# EAGLE design SunriseClockMainv3 (EAGLE 7.6.0)
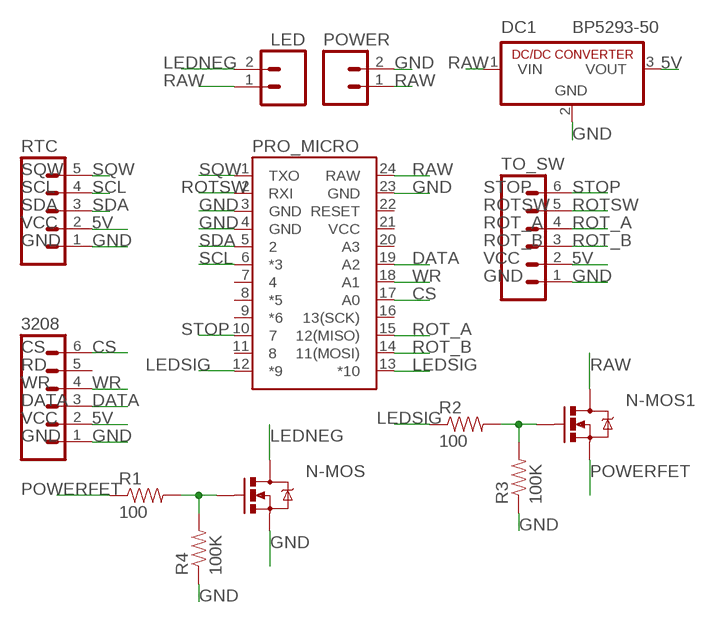
[diagram p0: schematic, sheet 1]

## Parts
3208  M06LOCK  [1X06_LOCK]
DC1  BP5293-50  R-78C5.0-1.0  [SIP3]
LED  M02LOCK  [1X02_LOCK]
N-MOS  MOSFET-NCHANNELFQP30N06L  [TO220V]
N-MOS1  MOSFET-NCHANNELFQP30N06L  [TO220V]
POWER  M025MM  [SCREWTERMINAL-5MM-2]
PRO_MICRO  ARDUINO_PRO_MICRO  [ARDUINO_PRO_MICRO]
R1  100  RESISTORPTH-1/4W  [AXIAL-0.4]
R2  100  RESISTORPTH-1/4W  [AXIAL-0.4]
R3  100K  RESISTORPTH-1/4W  [AXIAL-0.4]
R4  100K  RESISTORPTH-1/4W  [AXIAL-0.4]
RTC  M05LOCK  [1X05_LOCK]
TO_SW  M06LOCK  [1X06_LOCK]

## Nets
5V: 3208.2 DC1.3(VOUT) RTC.2 TO_SW.2
CS: 3208.6 PRO_MICRO.17(A0)
DATA: 3208.3 PRO_MICRO.19(A2)
GND: 3208.1 DC1.2(GND) N-MOS.3(S) POWER.2 PRO_MICRO.3(GND) PRO_MICRO.4(GND) PRO_MICRO.23(GND) R3.P$1 R4.P$1 RTC.1 TO_SW.1
LEDNEG: LED.2 N-MOS.2(D)
LEDSIG: PRO_MICRO.12(*9) PRO_MICRO.13(*10) R2.P$1
N$1: N-MOS.1(G) R1.P$2 R4.P$2
N$2: N-MOS1.1(G) R2.P$2 R3.P$2
POWERFET: N-MOS1.3(S) R1.P$1
RAW: DC1.1(VIN) LED.1 N-MOS1.2(D) POWER.1 PRO_MICRO.24(RAW)
ROT_A: PRO_MICRO.15(12(MISO)) TO_SW.4
ROT_B: PRO_MICRO.14(11(MOSI)) TO_SW.3
ROTSW: PRO_MICRO.2(RXI) TO_SW.5
SCL: PRO_MICRO.6(*3) RTC.4
SDA: PRO_MICRO.5 RTC.3
SQW: PRO_MICRO.1(TXO) RTC.5
STOP: PRO_MICRO.10 TO_SW.6
WR: 3208.4 PRO_MICRO.18(A1)
Unconnected: 3208.5 PRO_MICRO.7 PRO_MICRO.8(*5) PRO_MICRO.9(*6) PRO_MICRO.11 PRO_MICRO.16(13(SCK)) PRO_MICRO.20(A3) PRO_MICRO.21(VCC) PRO_MICRO.22(RESET)

## Library data of the parts
3208 TO_SW = SparkFun-Connectors:M06: Header 6 Standard 6-pin 0.1" header. Use with straight break away headers (SKU : PRT-00116), right angle break away headers (PRT-00553), swiss pins (PRT-00743), machine pins (PRT-00117), and female headers (PRT-00115). Molex polarized connector foot print use with SKU : PRT-08094 with associated crimp pins and housings. NOTES ON THE VARIANTS LOCK and LOCK_LONGPADS... This footprint was designed to help hold the alignment of a through-hole component (i.e. 6-pin header) while soldering it into place. You may notice that each hole has been shifted either up or down by 0.005 of an inch from it's more standard position (which is a perfectly straight line). This slight alteration caused the pins (the squares in the middle) to touch the edges of the holes. Because they are alternating, it causes a "brace" to hold the component in place. 0.005 has proven to be the perfect amount of "off-center" position when using our standard breakaway headers. Although looks a little odd when you look at the bare footprint, once you have a header in there, the alteration is very hard to notice. Also,if you push a header all the way into place, it is covered up entirely on the bottom side. This idea of altering the position of holes to aid alignment will be further integrated into the Sparkfun Library for other footprints. It can help hold any component with 3 or more connection pins.
DC1 = dc-dc-converter:R-78C*-1.0: INNOLINE DC/DC-Converter 1.0 AMP SIP3 Single Output Source: Data sheet <http://www.mikrocontroller.net/attachment/150645/157764-da-01-en-DC_DC_WANDLER_R_78C5_0_1_0.pdf>
LED = SparkFun-Connectors:M02: Standard 2-pin 0.1" header. Use with - straight break away headers ( PRT-00116) - right angle break away headers (PRT-00553) - swiss pins (PRT-00743) - machine pins (PRT-00117) - female headers (PRT-00115) Molex polarized connector foot print use with: PRT-08233 with associated crimp pins and housings. 2.54_SCREWTERM for use with PRT-10571. 3.5mm Screw Terminal footprints for PRT-08084 5mm Screw Terminal footprints for use with PRT-08432
N-MOS N-MOS1 = SparkFun-DiscreteSemi:MOSFET-NCHANNEL: Common NMOSFET Parts MFG P/N Store ID Prod ID FDD8780 TRANS-09984 SI7820DN TRANS-11055 FDS6630A IC-08089 2N7002PW TRANS-11151 FQP30N06L COM-10213 TRANS-10060 BSS123LT1G TRANS-08345 BSS138 TRANS-00830 BS170 2N7000; PROD_ID: TRANS-10060
POWER = SparkFun-Connectors:M02: Standard 2-pin 0.1" header. Use with - straight break away headers ( PRT-00116) - right angle break away headers (PRT-00553) - swiss pins (PRT-00743) - machine pins (PRT-00117) - female headers (PRT-00115) Molex polarized connector foot print use with: PRT-08233 with associated crimp pins and housings. 2.54_SCREWTERM for use with PRT-10571. 3.5mm Screw Terminal footprints for PRT-08084 5mm Screw Terminal footprints for use with PRT-08432; STOREFRONT_ID: PRT-08432
PRO_MICRO = SparkFun-Boards:ARDUINO_PRO_MICRO
R1-R4 = SparkFun-Resistors:RESISTOR: Resistor Basic schematic elements and footprints for 0603, 1206, and PTH resistors.
RTC = SparkFun-Connectors:M05: Header 5 Standard 5-pin 0.1" header. Use with straight break away headers (SKU : PRT-00116), right angle break away headers (PRT-00553), swiss pins (PRT-00743), machine pins (PRT-00117), and female headers (PRT-00115). Molex polarized connector foot print use with SKU : PRT-08230 with associated crimp pins and housings.; GND: 1; SCL: 4; SDA: 3; SQW: 5; VCC: 2

## Net classes
0 default: width 0.305 mm, clearance 0.178 mm

## Board
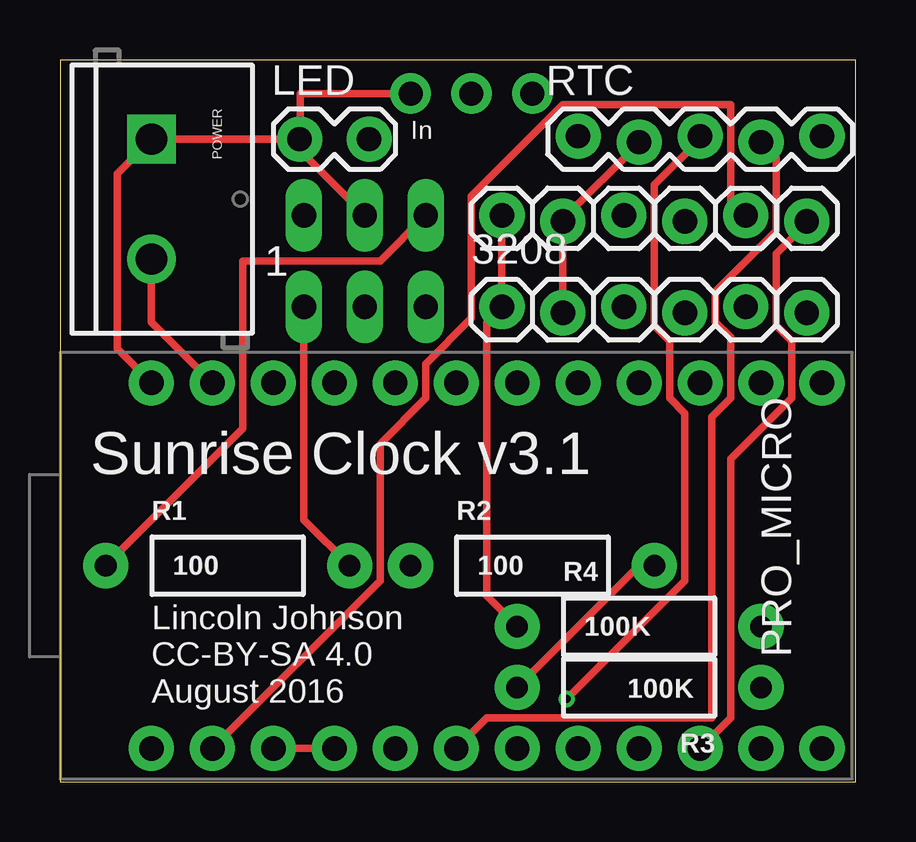
[diagram p1: board, top side]
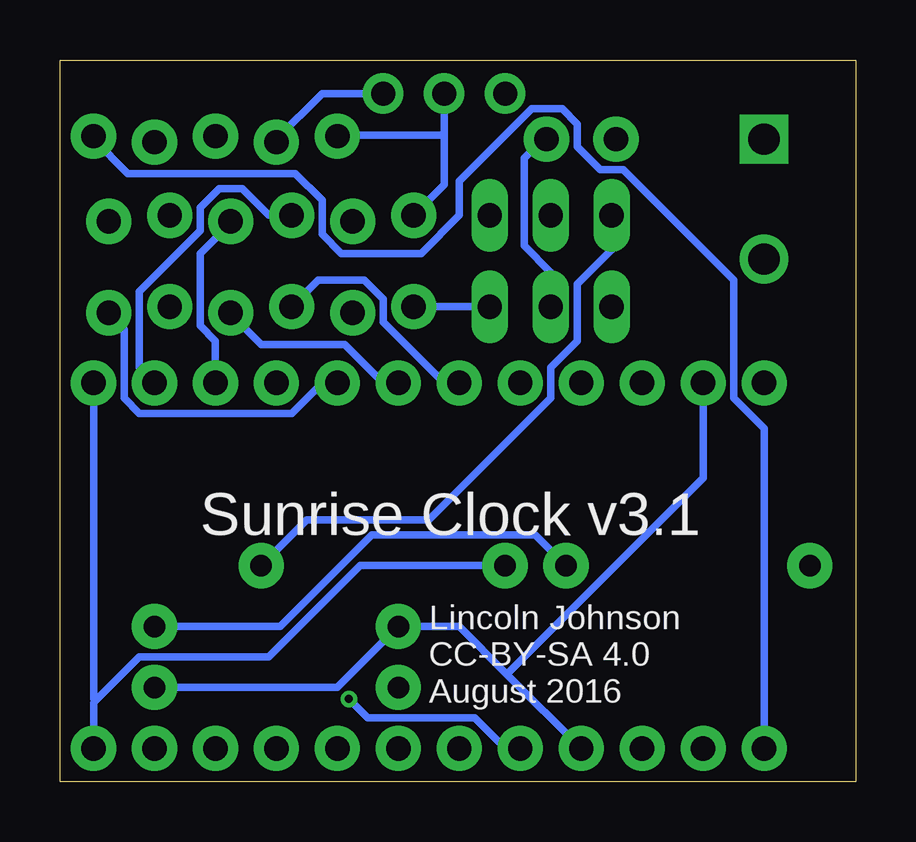
[diagram p2: board, bottom side, seen from below]

Size 33.15 x 30.1 mm. Coordinates in mm from the lower left corner, seen from the top.
Outline: 0,0 33.15,0 33.15,30.1 0,30.1 0,0
Copper layers (1*16): Top 0.0356mm / dielectric 1.5011mm / Bottom 0.0356mm
Design rules "oshpark-2layer": minimum track width 6mil, minimum drill 13mil, track to track 6mil, track to pad 6mil, pad to pad 6mil, via to via 6mil, smd to smd 6mil, copper to edge 15mil, drill to drill 6mil, minimum pad ring 7mil, minimum via ring 7mil, stop-mask expansion 2.5mil, vias tented up to drill 0mil, thermal gap 10mil

### Footprints (pad centres in the part's own frame; a part is rotated, then mirrored left to right if it is on the bottom)
1X06_LOCK = drill 1.016 pad 1.88: 1 0,0; 2 2.54,-0.254; 3 5.08,0; 4 7.62,-0.254; 5 10.16,0; 6 12.7,-0.254
SIP3 = drill 1 pad 1.676: 1 -2.54,0; 2 0,0; 3 2.54,0
1X02_LOCK = drill 1.016 pad 1.88: 1 -0.178,0; 2 2.718,0
TO220V = drill 1.016 long: 1 -2.54,0; 2 0,0; 3 2.54,0
SCREWTERMINAL-5MM-2 = drill 1.3 pad 2.032 square: 1 0,0 | drill 1.3 pad 2.032: 2 5,0
ARDUINO_PRO_MICRO = drill 1.016 pad 1.88: 1 -7.62,12.7; 2 -7.62,10.16; 3 -7.62,7.62; 4 -7.62,5.08; 5 -7.62,2.54; 6 -7.62,0; 7 -7.62,-2.54; 8 -7.62,-5.08; 9 -7.62,-7.62; 10 -7.62,-10.16; 11 -7.62,-12.7; 12 -7.62,-15.24; 13 7.62,-15.24; 14 7.62,-12.7; 15 7.62,-10.16; 16 7.62,-7.62; 17 7.62,-5.08; 18 7.62,-2.54; 19 7.62,0; 20 7.62,2.54; 21 7.62,5.08; 22 7.62,7.62; 23 7.62,10.16; 24 7.62,12.7
AXIAL-0.4 = drill 0.9 pad 1.88: P$1 -5.08,0; P$2 5.08,0
1X05_LOCK = drill 1.016 pad 1.88: 1 0,0.127; 2 2.54,-0.127; 3 5.08,0.127; 4 7.62,-0.127; 5 10.16,0.127

### Placement (x,y rotation side)
3208  18.41,19.81 0 top
DC1  17.14,28.7 0 top
LED  10.16,26.8 0 top
N-MOS  12.7,19.81 0 top
N-MOS1  12.7,23.62 0 top
POWER  3.81,26.8 270 top
PRO_MICRO  16.51,9.02 90 top
R1  6.99,9.02 0 top
R2  19.68,9.02 0 top
R3  24.13,3.94 180 top
R4  24.13,6.48 0 top
RTC  21.59,26.8 0 top
TO_SW  18.41,23.62 0 top

### Tracks (layer width: path | path; a pad name or v marks a point on that pad's centre or on a via)
5V
  Top 0.305: 3208.2 TO_SW.2 20.95,23.46 24.13,26.64 RTC.2
  Bottom 0.305: DC1.3 22.23,28.7 24.13,26.8 RTC.2
CS
  Bottom 0.305: PRO_MICRO.17 22.23,16.64 23.5,15.37 29.84,15.37 30.48,16 30.48,18.86 31.11,19.49 3208.6
DATA
  Bottom 0.305: PRO_MICRO.19 17.14,16.64 19.68,19.18 19.68,20.13 20.48,20.92 22.38,20.92 3208.3
GND
  Top 0.305: TO_SW.1 3208.1 17.78,19.18 17.78,7.75 R4.P$1 | PRO_MICRO.23 3.81,19.18 POWER.2 | PRO_MICRO.4 PRO_MICRO.3
  Bottom 0.305: 3208.1 N-MOS.3 | 17.14,26.96 17.14,24.89 TO_SW.1 | 17.14,26.96 DC1.2 | 17.14,26.96 21.59,26.96 RTC.1 | PRO_MICRO.4 14.53,4.49 | 14.53,4.49 16.51,6.48 R4.P$1 21.59,3.94 R3.P$1 | PRO_MICRO.23 6.35,12.67 14.53,4.49
LEDNEG
  Bottom 0.305: N-MOS.2 12.7,21.24 13.81,22.35 13.81,26 13.02,26.8 LED.2
LEDSIG
  Bottom 0.305: R2.P$1 20.64,9.02 24.45,5.21 29.84,5.21 31.67,3.38 | 31.67,3.38 31.75,3.3 PRO_MICRO.12 | PRO_MICRO.13 31.75,3.46 31.67,3.38
N$1
  Top 0.305: N-MOS.1 10.16,10.92 R1.P$2
  Bottom 0.305: R4.P$2 23.97,6.48 20.16,10.29 13.34,10.29 R1.P$2
N$2
  Top 0.305: R3.P$2 24.13,9.02 R2.P$2
  Bottom 0.305: N-MOS1.1 10.16,22.19 11.59,20.77 11.59,18.38 12.7,17.27 12.7,16 17.78,10.92 22.86,10.92 R2.P$2
POWERFET
  Top 0.305: N-MOS1.3 13.34,21.72 7.62,21.72 7.62,14.73 R1.P$1
RAW
  Top 0.305: N-MOS1.2 10,26.32 10,26.8 | DC1.1 10,28.7 10,26.8 | 10,26.8 LED.1 POWER.1 2.38,25.37 2.38,18.07 PRO_MICRO.24
ROT_A
  Bottom 0.305: PRO_MICRO.15 26.67,18.38 27.3,19.02 27.3,22.03 26.04,23.3 TO_SW.4
ROT_B
  Bottom 0.305: TO_SW.3 24.45,23.62 25.56,24.73 26.51,24.73 27.3,23.94 27.3,22.99 29.84,20.45 29.84,17.27 PRO_MICRO.14
ROTSW
  Top 0.305: PRO_MICRO.2 13.34,8.38 13.34,14.1 15.24,16 15.24,17.43 17.14,19.34 17.14,24.42 20.95,28.23 27.94,28.23 27.94,24.26 TO_SW.5
SCL
  Top 0.305: PRO_MICRO.6 17.78,2.67 27.15,2.67 27.15,15.21 27.94,16 27.94,18.54 27.3,19.18 27.3,20.45 29.84,22.99 29.84,26 29.21,26.64 RTC.4
SDA  (via drill 0.33)
  Top 0.305: v21.11,3.46 26.04,8.38 26.04,15.37 25.4,16 25.4,18.38 24.77,19.02 24.77,24.89 26.67,26.8 RTC.3
  Bottom 0.305: PRO_MICRO.5 14.61,1.4 15.88,2.67 20.32,2.67 v21.11,3.46
SQW
  Bottom 0.305: PRO_MICRO.1 3.81,14.73 5.08,16 5.08,20.92 9.68,25.53 10.64,25.53 11.59,26.48 11.59,27.43 12.22,28.07 13.49,28.07 16.51,25.05 16.51,23.62 18.1,22.03 21.43,22.03 22.23,22.83 22.23,24.26 23.34,25.37 30.32,25.37 31.75,26.8 RTC.5
STOP
  Top 0.305: PRO_MICRO.10 27.94,2.67 27.94,13.46 30.48,16 30.48,18.38 29.84,19.02 29.84,22.03 31.11,23.3 TO_SW.6
WR
  Bottom 0.305: PRO_MICRO.18 19.68,16.64 21.27,18.23 24.77,18.23 26.04,19.49 3208.4

### Text on the board
tPlace: Sunrise Clock v3.1 | Lincoln Johnson / CC-BY-SA 4.0 / August 2016
bPlace: Sunrise Clock v3.1 | Lincoln Johnson / CC-BY-SA 4.0 / August 2016
tNames: In | 1